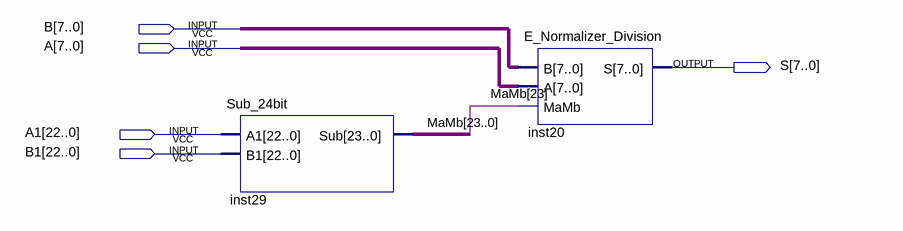
[diagram p0: schematic sheet]
// Quartus schematic E_Division_Normalizer.bdf as structural Verilog: 2 symbols, 5 pins
module E_Division_Normalizer (
  input  [7:0] B,
  input  [7:0] A,
  input  [22:0] A1,
  input  [22:0] B1,
  output [7:0] S
);

  wire [23:0] MaMb;

  Sub_24bit inst29 (.A1(A1), .B1(B1), .Sub(MaMb));
  E_Normalizer_Division inst20 (.B(B), .A(A), .MaMb(MaMb[23]), .S(S));
endmodule
